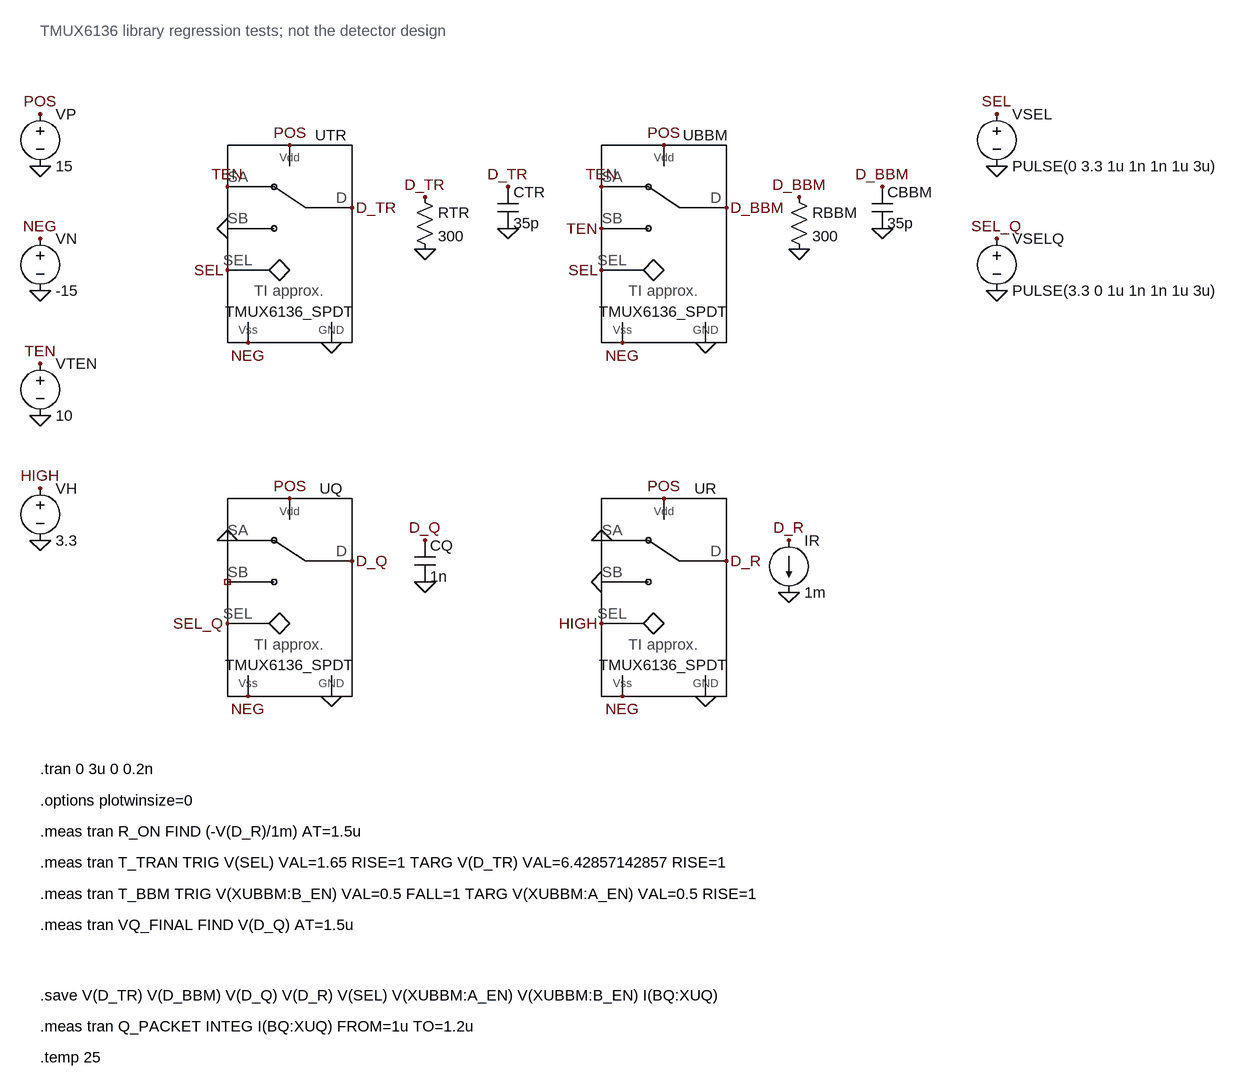
[diagram p0: schematic tmux6136_model_tests.asc]
tmux6136_model_tests.asc, the LTspice schematic file:
Version 4
SHEET 1 880 680
FLAG 384 384 SEL
FLAG 384 256 TEN
FLAG 384 320 0
FLAG 576 288 D_TR
FLAG 416 496 NEG
FLAG 480 192 POS
FLAG 544 496 0
FLAG 960 384 SEL
FLAG 960 256 TEN
FLAG 960 320 TEN
FLAG 1152 288 D_BBM
FLAG 992 496 NEG
FLAG 1056 192 POS
FLAG 1120 496 0
FLAG 384 928 SEL_Q
FLAG 384 800 0
FLAG 576 832 D_Q
FLAG 416 1040 NEG
FLAG 480 736 POS
FLAG 544 1040 0
FLAG 960 928 HIGH
FLAG 960 800 0
FLAG 960 864 0
FLAG 1152 832 D_R
FLAG 992 1040 NEG
FLAG 1056 736 POS
FLAG 1120 1040 0
FLAG 96 144 POS
FLAG 96 224 0
FLAG 96 336 NEG
FLAG 96 416 0
FLAG 96 528 TEN
FLAG 96 608 0
FLAG 96 720 HIGH
FLAG 96 800 0
FLAG 1568 144 SEL
FLAG 1568 224 0
FLAG 1568 336 SEL_Q
FLAG 1568 416 0
FLAG 688 272 D_TR
FLAG 688 352 0
FLAG 1264 272 D_BBM
FLAG 1264 352 0
FLAG 816 256 D_TR
FLAG 816 320 0
FLAG 1392 256 D_BBM
FLAG 1392 320 0
FLAG 688 800 D_Q
FLAG 688 864 0
FLAG 1248 800 D_R
FLAG 1248 880 0
SYMBOL Switches/TMUX6136_SPDT 480 336 R0
SYMATTR InstName UTR
SYMBOL Switches/TMUX6136_SPDT 1056 336 R0
SYMATTR InstName UBBM
SYMBOL Switches/TMUX6136_SPDT 480 880 R0
SYMATTR InstName UQ
SYMATTR SpiceLine IOFF=0 ION=0
SYMBOL Switches/TMUX6136_SPDT 1056 880 R0
SYMATTR InstName UR
SYMBOL voltage 96 128 R0
SYMATTR InstName VP
SYMATTR Value 15
SYMBOL voltage 96 320 R0
SYMATTR InstName VN
SYMATTR Value -15
SYMBOL voltage 96 512 R0
SYMATTR InstName VTEN
SYMATTR Value 10
SYMBOL voltage 96 704 R0
SYMATTR InstName VH
SYMATTR Value 3.3
SYMBOL voltage 1568 128 R0
SYMATTR InstName VSEL
SYMATTR Value PULSE(0 3.3 1u 1n 1n 1u 3u)
SYMBOL voltage 1568 320 R0
SYMATTR InstName VSELQ
SYMATTR Value PULSE(3.3 0 1u 1n 1n 1u 3u)
SYMBOL res 672 256 R0
SYMATTR InstName RTR
SYMATTR Value 300
SYMBOL res 1248 256 R0
SYMATTR InstName RBBM
SYMATTR Value 300
SYMBOL cap 800 256 R0
SYMATTR InstName CTR
SYMATTR Value 35p
SYMBOL cap 1376 256 R0
SYMATTR InstName CBBM
SYMATTR Value 35p
SYMBOL cap 672 800 R0
SYMATTR InstName CQ
SYMATTR Value 1n
SYMBOL current 1248 800 R0
SYMATTR InstName IR
SYMATTR Value 1m
TEXT 96 1152 Left 2 !.tran 0 3u 0 0.2n
TEXT 96 1200 Left 2 !.options plotwinsize=0
TEXT 96 1248 Left 2 !.meas tran R_ON FIND (-V(D_R)/1m) AT=1.5u
TEXT 96 1296 Left 2 !.meas tran T_TRAN TRIG V(SEL) VAL=1.65 RISE=1 TARG V(D_TR) VAL=6.42857142857 RISE=1
TEXT 96 1344 Left 2 !.meas tran T_BBM TRIG V(XUBBM:B_EN) VAL=0.5 FALL=1 TARG V(XUBBM:A_EN) VAL=0.5 RISE=1
TEXT 96 1392 Left 2 !.meas tran VQ_FINAL FIND V(D_Q) AT=1.5u
TEXT 96 16 Left 2 ;TMUX6136 library regression tests; not the detector design
TEXT 96 1500 Left 2 !.save V(D_TR) V(D_BBM) V(D_Q) V(D_R) V(SEL) V(XUBBM:A_EN) V(XUBBM:B_EN) I(BQ:XUQ)
TEXT 96 1548 Left 2 !.meas tran Q_PACKET INTEG I(BQ:XUQ) FROM=1u TO=1.2u
TEXT 96 1596 Left 2 !.temp 25

The netlist it stands for:
* tmux6136_model_tests.asc
XUTR SEL TEN D_TR 0 NEG 0 POS TMUX6136_SPDT  ; pins IN SA D SB Vss GND Vdd
XUBBM SEL TEN D_BBM TEN NEG 0 POS TMUX6136_SPDT  ; pins IN SA D SB Vss GND Vdd
XUQ SEL_Q 0 D_Q NC_01 NEG 0 POS TMUX6136_SPDT IOFF=0 ION=0  ; pins IN SA D SB Vss GND Vdd
XUR HIGH 0 D_R 0 NEG 0 POS TMUX6136_SPDT  ; pins IN SA D SB Vss GND Vdd
VP POS 0 15
VN NEG 0 -15
VTEN TEN 0 10
VH HIGH 0 3.3
VSEL SEL 0 PULSE(0 3.3 1u 1n 1n 1u 3u)
VSELQ SEL_Q 0 PULSE(3.3 0 1u 1n 1n 1u 3u)
RTR D_TR 0 300
RBBM D_BBM 0 300
CTR D_TR 0 35p
CBBM D_BBM 0 35p
CQ D_Q 0 1n
IR D_R 0 1m
.tran 0 3u 0 0.2n
.options plotwinsize=0
.meas tran R_ON FIND (-V(D_R)/1m) AT=1.5u
.meas tran T_TRAN TRIG V(SEL) VAL=1.65 RISE=1 TARG V(D_TR) VAL=6.42857142857 RISE=1
.meas tran T_BBM TRIG V(XUBBM:B_EN) VAL=0.5 FALL=1 TARG V(XUBBM:A_EN) VAL=0.5 RISE=1
.meas tran VQ_FINAL FIND V(D_Q) AT=1.5u
* TMUX6136 library regression tests; not the detector design
.save V(D_TR) V(D_BBM) V(D_Q) V(D_R) V(SEL) V(XUBBM:A_EN) V(XUBBM:B_EN) I(BQ:XUQ)
.meas tran Q_PACKET INTEG I(BQ:XUQ) FROM=1u TO=1.2u
.temp 25
.lib TMUX6136_extended.lib
.backanno
.end